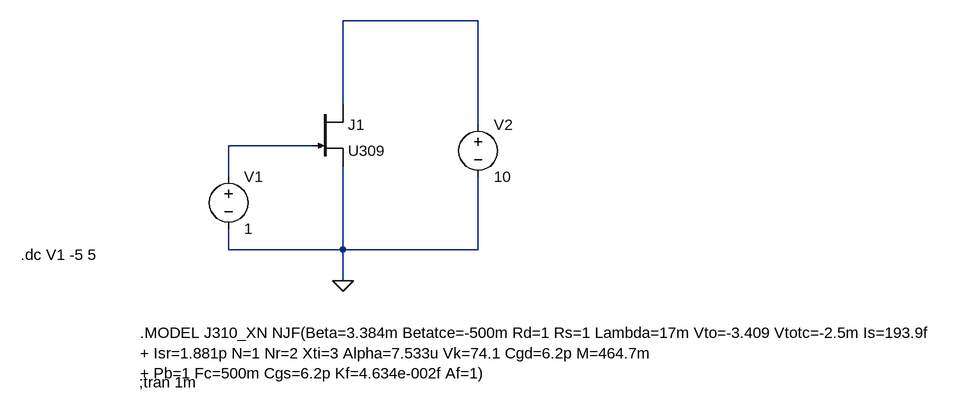
[diagram p0: schematic J310.asc]
J310.asc, the LTspice schematic file:
Version 4
SHEET 1 1568 680
WIRE 672 -208 464 -208
WIRE 464 -80 464 -208
WIRE 672 -48 672 -208
WIRE 416 -16 288 -16
WIRE 288 32 288 -16
WIRE 288 144 288 112
WIRE 464 144 464 16
WIRE 464 144 288 144
WIRE 672 144 672 32
WIRE 672 144 464 144
WIRE 464 192 464 144
FLAG 464 192 0
SYMBOL voltage 288 16 R0
WINDOW 123 0 0 Left 2
WINDOW 39 0 0 Left 2
SYMATTR InstName V1
SYMATTR Value 1
SYMBOL voltage 672 -64 R0
WINDOW 123 0 0 Left 2
WINDOW 39 0 0 Left 2
SYMATTR InstName V2
SYMATTR Value 10
SYMBOL njf 416 -80 R0
SYMATTR InstName J1
SYMATTR Value U309
TEXT 152 272 Left 2 !.MODEL J310_XN NJF(Beta=3.384m Betatce=-500m Rd=1 Rs=1 Lambda=17m Vto=-3.409 Vtotc=-2.5m Is=193.9f\n+ Isr=1.881p N=1 Nr=2 Xti=3 Alpha=7.533u Vk=74.1 Cgd=6.2p M=464.7m\n+ Pb=1 Fc=500m Cgs=6.2p Kf=4.634e-002f Af=1)
TEXT 150 348 Left 2 !;tran 1m
TEXT -32 152 Left 2 !.dc V1 -5 5

The netlist it stands for:
* J310.asc
V1 N002 0 1
V2 N001 0 10
J1 N001 N002 0 U309
.model NJF NJF
.model PJF PJF
.lib standard.jft
.MODEL J310_XN NJF(Beta=3.384m Betatce=-500m Rd=1 Rs=1 Lambda=17m Vto=-3.409 Vtotc=-2.5m Is=193.9f
+ Isr=1.881p N=1 Nr=2 Xti=3 Alpha=7.533u Vk=74.1 Cgd=6.2p M=464.7m
+ Pb=1 Fc=500m Cgs=6.2p Kf=4.634e-002f Af=1)
;tran 1m
.dc V1 -5 5
.backanno
.end